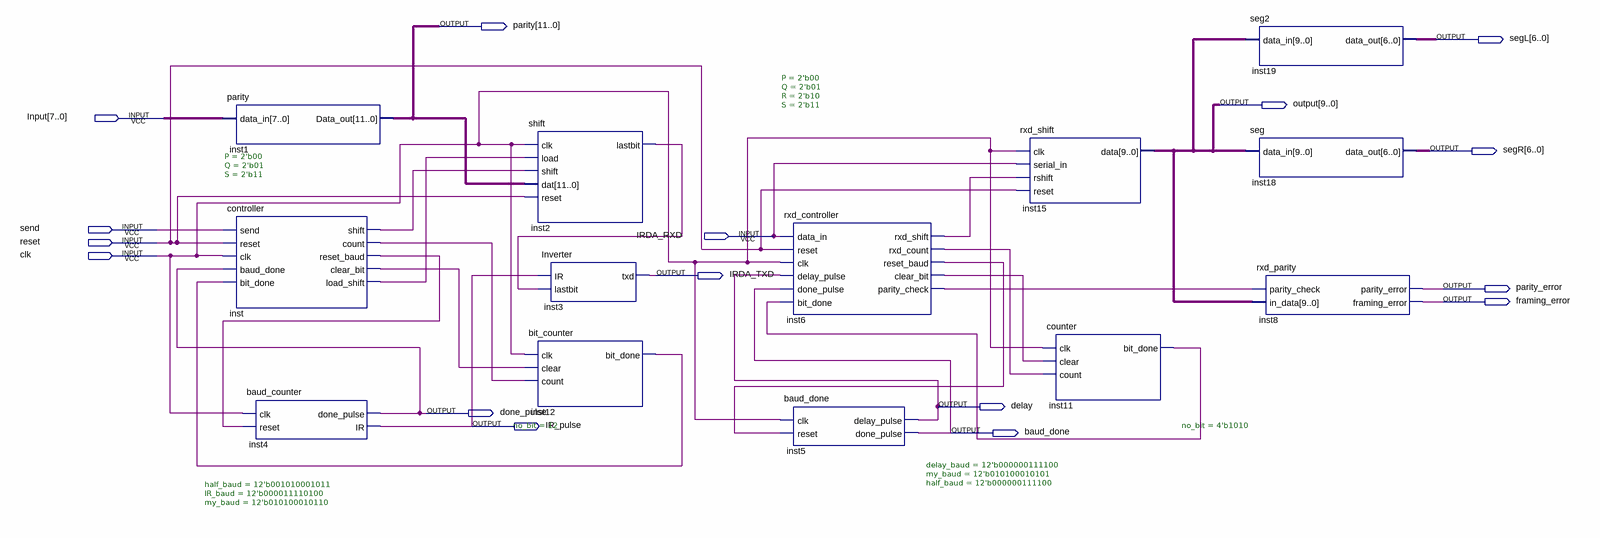
[diagram p0: schematic sheet]
// Quartus schematic IRtransceiver.bdf as structural Verilog: 13 symbols, 16 pins
module IRtransceiver (
  input  [7:0] Input,
  input  send,
  input  IRDA_RXD,
  input  reset,
  input  clk,
  output [11:0] parity,
  output [6:0] segL,
  output [9:0] \output ,
  output [6:0] segR,
  output IRDA_TXD,
  output parity_error,
  output framing_error,
  output delay,
  output done_pulse,
  output IR_pulse,
  output baud_done
);

  wire inst2_lastbit, inst6_clear_bit, inst6_parity_check, inst6_reset_baud, inst6_rxd_count,
       inst6_rxd_shift, inst11_bit_done, inst12_bit_done, inst_clear_bit, inst_count, inst_load_shift,
       inst_reset_baud, inst_shift;

  parity inst1 (.data_in(Input), .Data_out(parity));
  controller #(.P(2'b00), .Q(2'b01), .S(2'b11)) inst (
    .send(send), .reset(reset), .clk(clk), .baud_done(done_pulse), .bit_done(inst12_bit_done),
    .shift(inst_shift), .count(inst_count), .reset_baud(inst_reset_baud), .clear_bit(inst_clear_bit),
    .load_shift(inst_load_shift));
  baud_counter #(.half_baud(12'b001010001011), .IR_baud(12'b000011110100), .my_baud(12'b010100010110)) inst4 (
    .clk(clk), .reset(inst_reset_baud), .done_pulse(done_pulse), .IR(IR_pulse));
  shift inst2 (
    .clk(clk), .load(inst_load_shift), .shift(inst_shift), .dat(parity), .reset(reset),
    .lastbit(inst2_lastbit));
  Inverter inst3 (.IR(IR_pulse), .lastbit(inst2_lastbit), .txd(IRDA_TXD));
  bit_counter #(.no_bit(12)) inst12 (.clk(clk), .clear(inst_clear_bit), .count(inst_count), .bit_done(inst12_bit_done));
  rxd_controller #(.P(2'b00), .Q(2'b01), .R(2'b10), .S(2'b11)) inst6 (
    .data_in(IRDA_RXD), .reset(reset), .clk(clk), .delay_pulse(delay), .done_pulse(baud_done),
    .bit_done(inst11_bit_done), .rxd_shift(inst6_rxd_shift), .rxd_count(inst6_rxd_count),
    .reset_baud(inst6_reset_baud), .clear_bit(inst6_clear_bit), .parity_check(inst6_parity_check));
  baud_done #(.delay_baud(12'b000000111100), .my_baud(12'b010100010101), .half_baud(12'b000000111100)) inst5 (
    .clk(clk), .reset(inst6_reset_baud), .delay_pulse(delay), .done_pulse(baud_done));
  rxd_shift inst15 (.clk(clk), .serial_in(IRDA_RXD), .rshift(inst6_rxd_shift), .reset(reset), .data(\output ));
  counter #(.no_bit(4'b1010)) inst11 (
    .clk(clk), .clear(inst6_clear_bit), .count(inst6_rxd_count), .bit_done(inst11_bit_done));
  seg2 inst19 (.data_in(\output ), .data_out(segL));
  seg inst18 (.data_in(\output ), .data_out(segR));
  rxd_parity inst8 (
    .parity_check(inst6_parity_check), .in_data(\output ), .parity_error(parity_error),
    .framing_error(framing_error));
endmodule
